# Altium schematic sheet Connectors.SchDoc
size A3
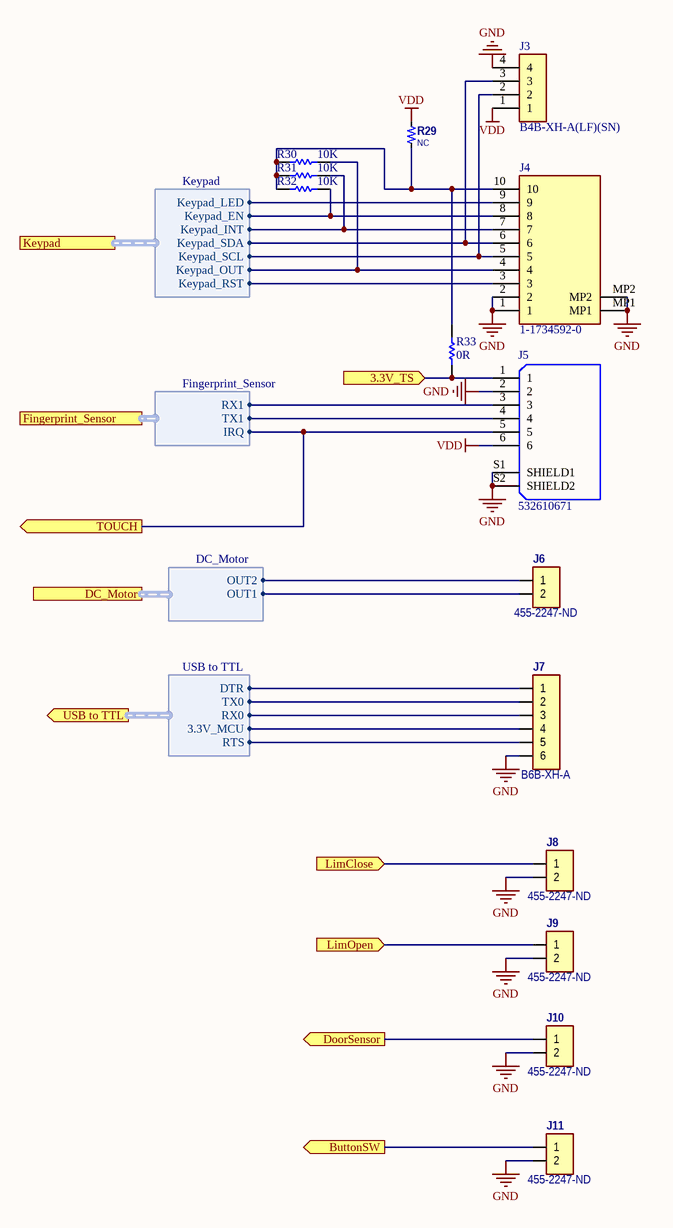
[diagram p0: Connectors.SchDoc]

## Parts
J3  B4B-XH-A(LF)(SN)  [JST_B4B-XH-A(LF)(SN)]
J4  1-1734592-0  [117345920]
J5  532610671  [MOLEX_532610671]
J6  455-2247-ND  [CON_HDR1x2]
J7  B6B-XH-A  [CON_HDR1x6_2p50_SHRD_JST-B6B-XH-A]
J8  455-2247-ND  [CON_HDR1x2]
J9  455-2247-ND  [CON_HDR1x2]
J10  455-2247-ND  [CON_HDR1x2]
J11  455-2247-ND  [CON_HDR1x2]
R29  NC  [0603-R]
R30  10K  [0603R]
R31  10K  [0603R]
R32  10K  [0603R]
R33  0R  [0603R]

## Ports
3.3V_TS (in), ButtonSW (out), DC_Motor (harness DC_Motor), DoorSensor (out), Fingerprint_Sensor (harness Fingerprint_Sensor), Keypad (harness Keypad), LimClose (in), LimOpen (in), TOUCH (out), USB to TTL (out, harness USB to TTL)

## Harnesses
Keypad: Keypad_RST, Keypad_EN, Keypad_SDA, Keypad_SCL, Keypad_OUT, Keypad_INT, Keypad_LED
Fingerprint_Sensor: RX1, TX1, IRQ
DC_Motor: OUT1, OUT2
USB to TTL: TX0, RX0, DTR, RTS, 3.3V_MCU

## Nets
GND: J3.4 J4.1 J4.2 J4.MP1 J4.MP2 J5.2 J5.S1(SHIELD1) J5.S2(SHIELD2) J7.6 J8.2 J9.2 J10.2 J11.2
VDD: J3.1 J5.6 R29.2
3.3V_TS: J5.1 R33.1 ; port 3.3V_TS
ButtonSW: J11.1 ; port ButtonSW
DoorSensor: J10.1 ; port DoorSensor
LimClose: J8.1 ; port LimClose
LimOpen: J9.1 ; port LimOpen
TOUCH: J5.5 ; port TOUCH, port Fingerprint_Sensor.IRQ
NetJ3_2: J3.2 J4.5 ; port Keypad.Keypad_SCL
NetJ3_3: J3.3 J4.6 ; port Keypad.Keypad_SDA
NetJ4_3: J4.3 ; port Keypad.Keypad_RST
NetJ4_4: J4.4 R30.2 ; port Keypad.Keypad_OUT
NetJ4_7: J4.7 R31.2 ; port Keypad.Keypad_INT
NetJ4_8: J4.8 R32.2 ; port Keypad.Keypad_EN
NetJ4_9: J4.9 ; port Keypad.Keypad_LED
NetJ4_10: J4.10 R29.1 R30.1 R31.1 R32.1 R33.2
NetJ5_3: J5.3 ; port Fingerprint_Sensor.RX1
NetJ5_4: J5.4 ; port Fingerprint_Sensor.TX1
NetJ6_1: J6.1 ; port DC_Motor.OUT2
NetJ6_2: J6.2 ; port DC_Motor.OUT1
NetJ7_1: J7.1 ; port USB to TTL.DTR
NetJ7_2: J7.2 ; port USB to TTL.TX0
NetJ7_3: J7.3 ; port USB to TTL.RX0
NetJ7_4: J7.4 ; port USB to TTL.3.3V_MCU
NetJ7_5: J7.5 ; port USB to TTL.RTS

## Library data of the parts
J3 = B4B-XH-A(LF)(SN): Connector Header Through Hole 4 position 0.098 (2.50mm); MF: JST Sales; Check_prices: https://www.snapeda.com/parts/B4B-XH-A(LF)(SN)/JST%20Sales%20America%20Inc./view-part/447494/?ref=eda; Purchase-URL: https://pricing.snapeda.com/search/part/B4B-XH-A(LF)(SN)/?ref=eda; SnapEDA_Link: https://www.snapeda.com/parts/B4B-XH-A(LF)(SN)/JST%20Sales%20America%20Inc./view-part/447494/?ref=snap; Price: None; Value: *; MP: B4B-XH-A(LF)(SN); Package: None; Availability: Warning
J4 = 1-1734592-0: Connector; Manufacturer_Name: TE Connectivity; Datasheet Link: https://www.te.com/commerce/DocumentDelivery/DDEController?Action=showdoc&DocId=Customer+Drawing%7F1734592%7FC%7Fpdf%7FEnglish%7FENG_CD_1734592_C_C_1734592.pdf%7F1-1734592-8; Height: 2.3mm; Manufacturer_Part_Number: 1-1734592-0; Mouser Part Number: 571-1-1734592-0; Mouser Price/Stock: https://www.mouser.co.uk/ProductDetail/TE-Connectivity/1-1734592-0?qs=sXy4Dx%2FMQpOH8ogf8%2FvwBg%3D%3D; Arrow Part Number: 1-1734592-0; Arrow Price/Stock: https://www.arrow.com/en/products/1-1734592-0/te-connectivity
J5 = 532610671: Conn Shrouded Header (4 Sides) HDR 6 POS 1.25mm Solder RA Side Entry SMD PicoBladeâ„¢ T/R; MF: Molex; SnapEDA_Link: https://www.snapeda.com/parts/532610671/Molex/view-part/6379096/?ref=snap; Value: *; Purchase-URL: https://pricing.snapeda.com/search/part/532610671/?ref=eda; Check_prices: https://www.snapeda.com/parts/532610671/Molex/view-part/6379096/?ref=eda; MP: 532610671; Digi-Key_Part_Number: WM7624CT-ND; Package: None
J6 J8-J11 = CON_HDR1x2: ComponentLink1URL: https://www.jst-mfg.com/product/pdf/eng/eXH.pdf; ComponentLink1Description: Datasheet
J7 = CON_HDR1x6_2p50_SHRD_JST_B6B-XH-A: CONN HEADER VERT 6POS 2.5MM; Manufacturer: JST; Manufacturer Part Number: B6BXHA(LF)(SN); Contact Resistance: 20mR; Current Rating: 3A; Number of Positions: 6; Voltage Rating (AC): 250V; Insulation Resistance: 1GR; Connector Type: Male Pin; Wire/Cable Gauge: 22AWG; ComponentLink4Description: Datasheet; ComponentLink4URL: http://www.jst-mfg.com/product/pdf/eng/eXH.pdf; Supplier 1: Digi-Key; RoHS: Yes; Category: FFC / FPC; Stock 1: 19126; Pricing 1: 1=0.270000, 10=0.258000, 100=0.180800, 500=0.154940, 1000=0.129120, 5000=0.110680, 10000=0.103300 (USD); Mount: Through Hole; Contact Plating: Tin,Lead,Copper; Contact Material: Brass; Color: Natural; Housing Color: White; Housing Material: Polyamide; Min Operating Temperature: -25°C; Max Operating Temperature: 85°C; Termination: Press-Fit; Package Quantity: 500; Packaging: Bulk; Number of Rows: 1; Voltage Rating: 250V; Number of Contacts: 6; Max Current Rating: 3A; Max Voltage Rating (AC): 250V; Max Voltage Rating (DC): 250V; Orientation: Straight; Length: 17.4mm; Depth: 5.75mm; Pitch: 2.5mm; Lead Pitch: 2.5mm; REACH SVHC: No SVHC; Lead Free: Lead Free; Supplier Part Number 1: 455-2271-ND
R29 = Res: Manufacturer: Panasonic; Manufacturer Part Number: ERJ-8GEYJ621V; Resistance: 620R; Tolerance: 5%; Voltage Rating: 200V; Temperature Coefficient: 200ppm/°C; Max Power Dissipation: 250mW; ComponentLink1URL: https://datasheet.ciiva.com/15193/getdatasheetpartid-366470-15193725.pdf?src-supplier=Verical; ComponentLink1Description: Datasheet; Supplier 1: Avnet; Stock 1: 6255; Pricing 1: 1 = 0.01200 (USD); RoHS: Yes; Mount: Surface Mount; Case Code (Metric): 3216; Case Code (Imperial): 1206; Contact Plating: Tin; Min Operating Temperature: -55°C; Max Operating Temperature: 155°C; Packaging: Tape and Reel; Package Quantity: 1; Resistor Type: Thick Film; Number of Terminations: 2; Voltage Rating (DC): 200V; Features: Automotive AEC-Q200; Series: ERJ; Construction: Rectangular; Resistance Tolerance: 5%; Length: 3.2mm; Width: 0.063inch; Height: 0.028inch; Depth: 1.6mm; Radiation Hardening: No; REACH SVHC: No SVHC; Military Standard: Not; Lead Free: Lead Free; RoHS Compliant: Yes; ComponentLink2URL: https://datasheet.ciiva.com/46387/1500035-46387094.pdf?src-supplier=Element14; ComponentLink2Description: https://datasheet.ciiva.com/46387/1500035-46387094.pdf?src-supplier=Element14; ComponentLink3URL: https://datasheet.ciiva.com/5915/1500035-5915369.pdf?src-supplier=Farnell; ComponentLink3Description: https://datasheet.ciiva.com/5915/1500035-5915369.pdf?src-supplier=Farnell; ComponentLink4URL: https://datasheet.ciiva.com/28677/1678796-28677018.pdf?src-supplier=Element14; ComponentLink4Description: https://datasheet.ciiva.com/28677/1678796-28677018.pdf?src-supplier=Element14; ComponentLink5URL: https://datasheet.ciiva.com/17204/aoa0000ce1-17204972.pdf?src-supplier=Avnet+Europe; ComponentLink5Description: https://datasheet.ciiva.com/17204/aoa0000ce1-17204972.pdf?src-supplier=Avnet+Europe; ComponentLink6URL: https://datasheet.ciiva.com/16515/aoa0000ce1-16515933.pdf?src-supplier=Avnet+Asia; ComponentLink6Description: https://datasheet.ciiva.com/16515/aoa0000ce1-16515933.pdf?src-supplier=Avnet+Asia; Supplier Part Number 1: 65T8955; Power Rating: 250mW; Case/Package: 0603
R30-R33 = res1: Resistor; Value: 1K; Published: 8-Jun-2000; Revision: July-2002: Re-released for DXP Platform.; Publisher: Altium Limited